# EAGLE design ESPMAX (EAGLE 6.5.0)
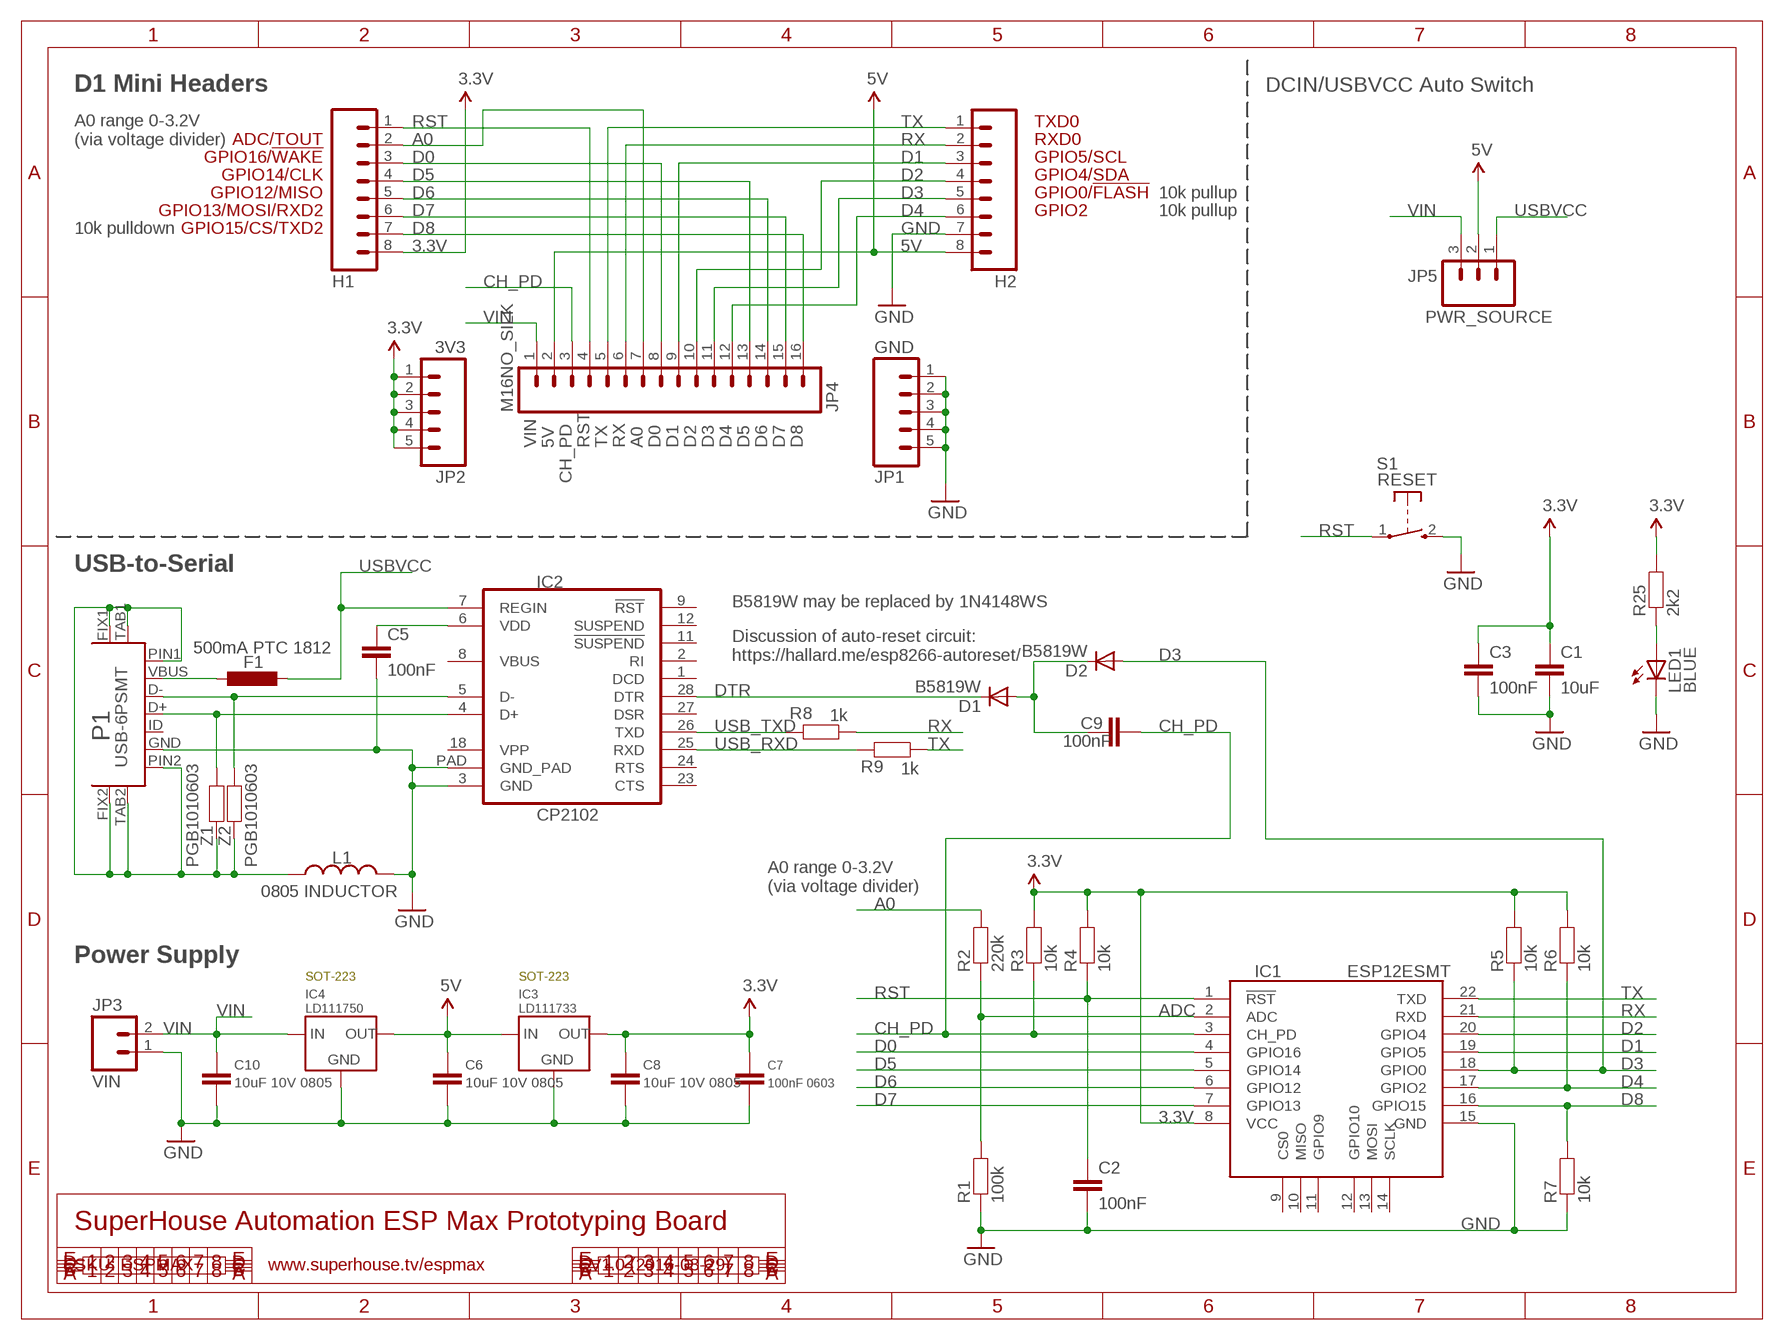
[diagram p0: schematic, sheet 1]

## Parts
C1  10uF  CAP0805  [0805]
C2  100nF  CAP0603  [0603]
C3  100nF  CAP0603  [0603]
C5  100nF  CAP0603  [0603]
C6  10uF 10V 0805  C-EUC0805  [C0805]
C7  100nF 0603  CAP0603  [0603]
C8  10uF 10V 0805  C-EUC0805  [C0805]
C9  100nF  CAP0603  [0603]
C10  10uF 10V 0805  C-EUC0805  [C0805]
D1  B5819W  DIODESOD  [SOD-323]
D2  B5819W  DIODESOD  [SOD-323]
F1  500mA PTC 1812  L-EUL1812  [L1812]
H1  M08  [1X08]
H2  M08  [1X08]
IC1  ESP12ESMT  [ESP12E]
IC2  CP2102  [QFN-28]
IC3  LD111733  LD1117-FIXED  [SOT-223]
IC4  LD111750  LD1117-FIXED  [SOT-223]
JP1  GND  M05NO_SILK  [1X05_NO_SILK]
JP2  3V3  M05NO_SILK  [1X05_NO_SILK]
JP3  VIN  M023.5MM  [SCREWTERMINAL-3.5MM-2]
JP4  M16NO_SILK  [1X16_NO_SILK]
JP5  PWR_SOURCE  M03PTH  [1X03]
L1  0805 INDUCTOR  INDUCTOR0805-LARGE  [0805-LARGE]
LED1  BLUE  LED0603  [LED-0603]
P1  USB-6PSMT  [USB-MICROB-MB05PMXX]
R1  100k  RESISTOR0603  [0603]
R2  220k  RESISTOR0603  [0603]
R3  10k  RESISTOR0603  [0603]
R4  10k  RESISTOR0603  [0603]
R5  10k  RESISTOR0603  [0603]
R6  10k  RESISTOR0603  [0603]
R7  10k  RESISTOR0603  [0603]
R8  1k  RESISTOR0603  [0603]
R9  1k  RESISTOR0603  [0603]
R25  2k2  RESISTOR0603  [0603]
S1  RESET  TAC_SWITCH_2PINSMT  [TACTILE_SWITCH_SMD_2PIN_TINY]
Z1  PGB1010603  RESISTOR0603  [0603]
Z2  PGB1010603  RESISTOR0603  [0603]

## Nets
3.3V: C1.1 C3.1 C7.1 C8.1 H1.8 IC1.8(VCC) IC3.2(OUT) IC3.4(OUT) JP2.1 JP2.2 JP2.3 JP2.4 JP2.5 R3.2 R4.2 R5.2 R6.2 R25.2
5V: C6.1 H2.8 IC3.3(IN) IC4.2(OUT) IC4.4(OUT) JP4.2 JP5.2
A0: H1.2 JP4.7 R2.2
ADC: IC1.2(ADC) R1.2 R2.1
CH_PD: C9.2 IC1.3(CH_PD) JP4.3 R3.1
D0: H1.3 IC1.4(GPIO16) JP4.8
D1: H2.3 IC1.19(GPIO5) JP4.9
D2: H2.4 IC1.20(GPIO4) JP4.10
D3: D2.2(A) H2.5 IC1.18(GPIO0) JP4.11 R5.1
D4: H2.6 IC1.17(GPIO2) JP4.12 R6.1
D5: H1.4 IC1.5(GPIO14) JP4.13
D6: H1.5 IC1.6(GPIO12) JP4.14
D7: H1.6 IC1.7(GPIO13) JP4.15
D8: H1.7 IC1.16(GPIO15) JP4.16 R7.2
DTR: D1.1(C) IC2.28(DTR)
GND: C1.2 C2.2 C3.2 C5.2 C6.2 C7.2 C8.2 C10.2 H2.7 IC1.15(GND) IC2.3(GND) IC2.PAD(GND_PAD) IC3.1(GND) IC4.1(GND) JP1.1 JP1.2 JP1.3 JP1.4 JP1.5 JP3.1 L1.2 LED1.C P1.GND R1.1 R7.1 S1.2(S)
N$23: LED1.A R25.1
N$86: C9.1 D1.2(A) D2.1(C)
N$92: L1.1 P1.FIX1 P1.FIX2 P1.PIN1 P1.PIN2 P1.TAB1 P1.TAB2 Z1.2 Z2.2
N$93: IC2.4(D+) P1.D+ Z1.1
N$94: IC2.5(D-) P1.D- Z2.1
N$95: C5.1 IC2.6(VDD)
N$115: F1.1 P1.VBUS
RST: C2.1 H1.1 IC1.1(!RST) JP4.4 R4.1 S1.1(P)
RX: H2.2 IC1.21(RXD) JP4.6 R8.1
TX: H2.1 IC1.22(TXD) JP4.5 R9.1
USB_RXD: IC2.25(RXD) R9.2
USB_TXD: IC2.26(TXD) R8.2
USBVCC: F1.2 IC2.7(REGIN) JP5.1
VIN: C10.1 IC4.3(IN) JP3.2 JP4.1 JP5.3
Unconnected: IC1.9(CS0) IC1.10(MISO) IC1.11(GPIO9) IC1.12(GPIO10) IC1.13(MOSI) IC1.14(SCLK) IC2.1(DCD) IC2.2(RI) IC2.8(VBUS) IC2.9(!RST) IC2.11(!SUSPEND) IC2.12(SUSPEND) IC2.18(VPP) IC2.23(CTS) IC2.24(RTS) IC2.27(DSR) P1.ID

## Notes on the sheet
- D1 Mini Headers | DCIN/USBVCC Auto Switch
- TXD0
- A0 range 0-3.2V
  (via voltage divider)
- ADC/TOUT | RXD0
- GPIO16/!WAKE | GPIO5/SCL
- GPIO14/CLK | GPIO4/SDA
- GPIO12/MISO | GPIO0/!FLASH | 10k pullup
- GPIO13/MOSI/RXD2 | GPIO2 | 10k pullup
- 10k pulldown | GPIO15/CS/TXD2
- VIN | 5V | RST | TX | RX | A0 | D0 | D1 | D2 | D3 | D4 | D5 | D6 | D7 | D8
- CH_PD
- USB-to-Serial
- B5819W may be replaced by 1N4148WS
- Discussion of auto-reset circuit:
  https://hallard.me/esp8266-autoreset/
- A0 range 0-3.2V
  (via voltage divider)
- Power Supply
- SOT-223 | SOT-223
- SuperHouse Automation ESP Max Prototyping Board
- SKU: ESPMAX | www.superhouse.tv/espmax | V1.0 (2016-03-29)

## Library data of the parts
C1-C3 C5 C9 = freetronics-jon:CAP: Capacitor Standard 0603 ceramic capacitor, and 0.1" leaded capacitor.
C6 C8 C10 = freetronics-jon:C-EU: CAPACITOR, European symbol
C7 = freetronics-master-v1:CAP: Capacitor Standard 0603 ceramic capacitor, and 0.1" leaded capacitor.
D1 D2 = freetronics-original:DIODE: Diode These are standard reverse protection diodes and small signal diodes. SMA package can handle up to about 1A. SOD-323 can handle about 200mA. What the SOD-323 package when ordering, there are some mfgs out there that are 5-pin packages.
F1 = rcl:L-EU: INDUCTOR, European symbol
H1 H2 = freetronics-original:M08: Header 8 Standard 8-pin 0.1" header. Use with straight break away headers (SKU : PRT-00116), right angle break away headers (PRT-00553), swiss pins (PRT-00743), machine pins (PRT-00117), and female headers (PRT-00115).
IC1 = freetronics-jon:ESP12E
IC2 = freetronics-jon:CP2102
IC3 IC4 = freetronics-luke:LD1117-FIXED: Fixed-voltage LD1117 series LDOs in SOT-223 package. Note that the ground pin is labelled as ground, not as adj, because it's not the adjustable-voltage part.
JP1 JP2 = freetronics-jon:M05: Header 5 Standard 5-pin 0.1" header. Use with straight break away headers (SKU : PRT-00116), right angle break away headers (PRT-00553), swiss pins (PRT-00743), machine pins (PRT-00117), and female headers (PRT-00115). Molex polarized connector foot print use with SKU : PRT-08230 with associated crimp pins and housings.
JP3 = freetronics-jon:M02: Header 2 Standard 2-pin 0.1" header. Use with straight break away headers (SKU : PRT-00116), right angle break away headers (PRT-00553), swiss pins (PRT-00743), machine pins (PRT-00117), and female headers (PRT-00115). Molex polarized connector foot print use with SKU : PRT-08233 with associated crimp pins and housings.
JP4 = freetronics-jon:M16
JP5 = freetronics-jon:M03: Header 3 Standard 3-pin 0.1" header. Use with straight break away headers (SKU : PRT-00116), right angle break away headers (PRT-00553), swiss pins (PRT-00743), machine pins (PRT-00117), and female headers (PRT-00115). Molex polarized connector foot print use with SKU : PRT-08232 with associated crimp pins and housings.
L1 = freetronics-master-v1:INDUCTOR: Inductors Basic Inductor/Choke - 0603 and 1206. Footprints are not proven and vary greatly between part numbers.
LED1 = freetronics-jon:LED: LEDs Standard schematic elements and footprints for 5mm, 3mm, 1206, and 0603 sized LEDs. 5mm - Spark Fun Electronics SKU : COM-00529 (and others)
P1 = freetronics-jon:USB-6P
R1-R9 R25 = freetronics-jon:RESISTOR: Resistor Basic schematic elements and footprints for 0603, 1206, and PTH 1/10th watt (small) resistors.
S1 = freetronics-jon:TAC_SWITCH_2PIN: Momentary Tactile Switch - 2 pin
Z1 Z2 = freetronics:RESISTOR: Resistor Basic schematic elements and footprints for 0603, 1206, and PTH 1/10th watt (small) resistors.

## Net classes
0 default: width 0.203 mm, drill 0.356 mm, clearance 0.152 mm
1 power: width 0.203 mm, clearance 0.152 mm

## Board
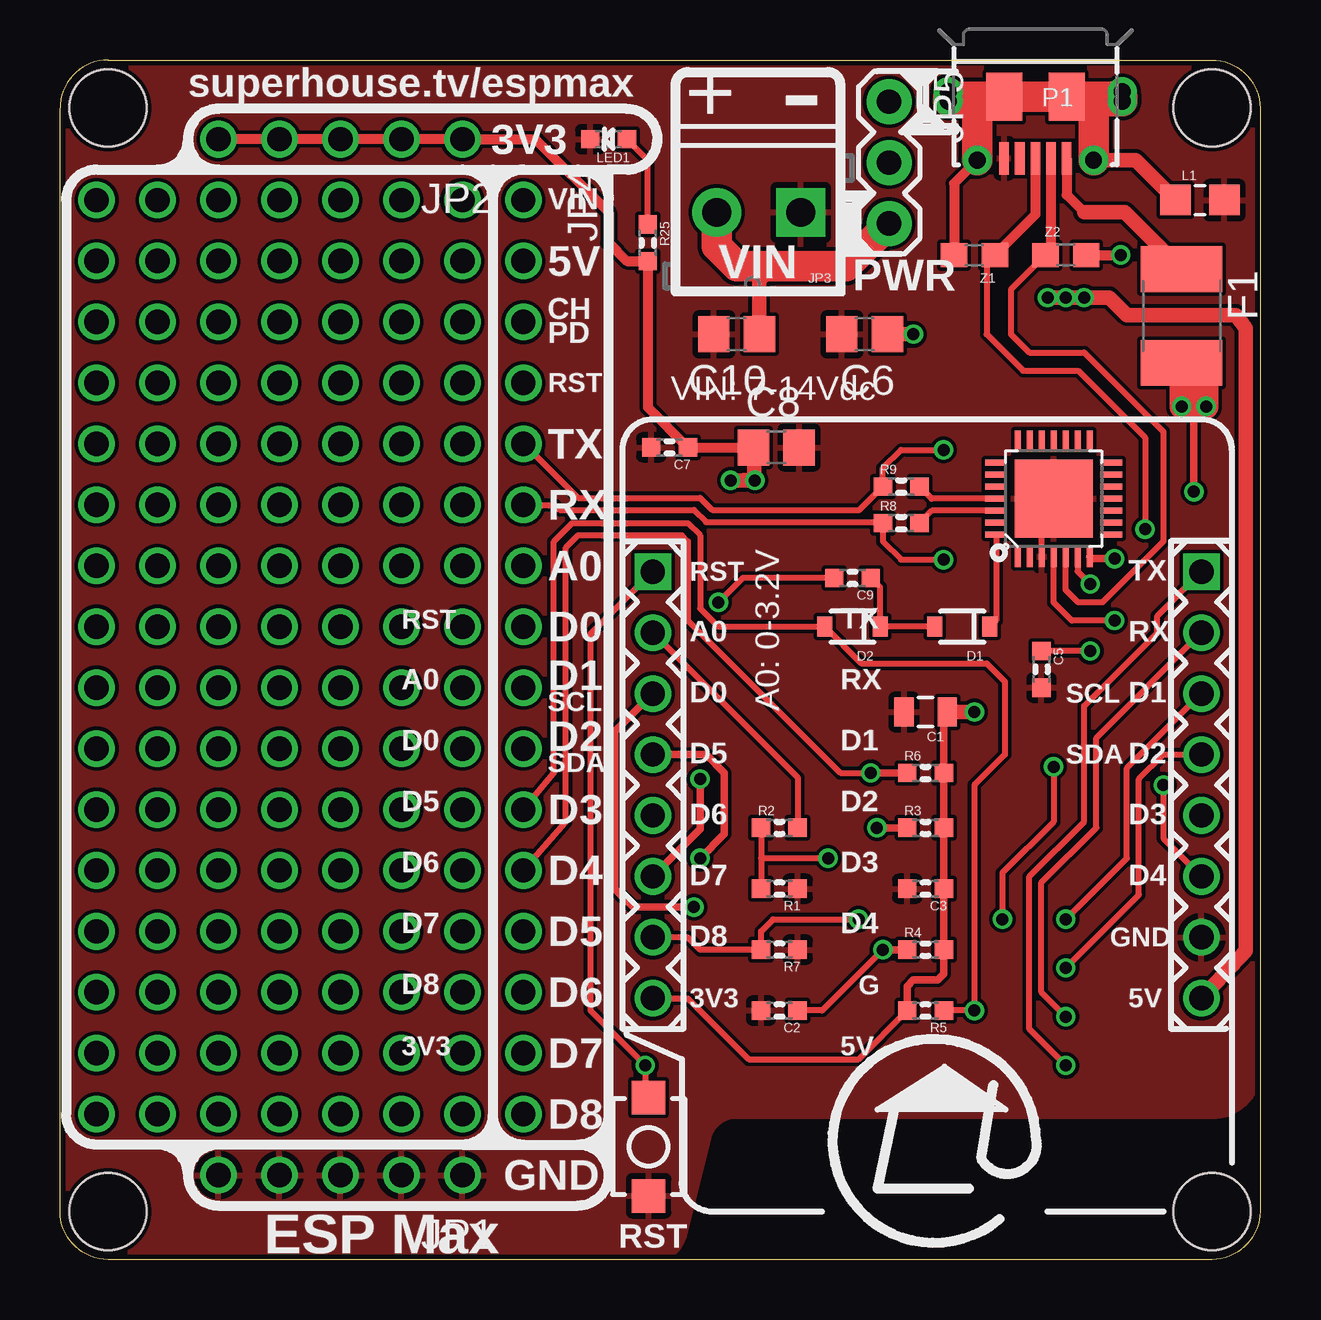
[diagram p1: board, top side]
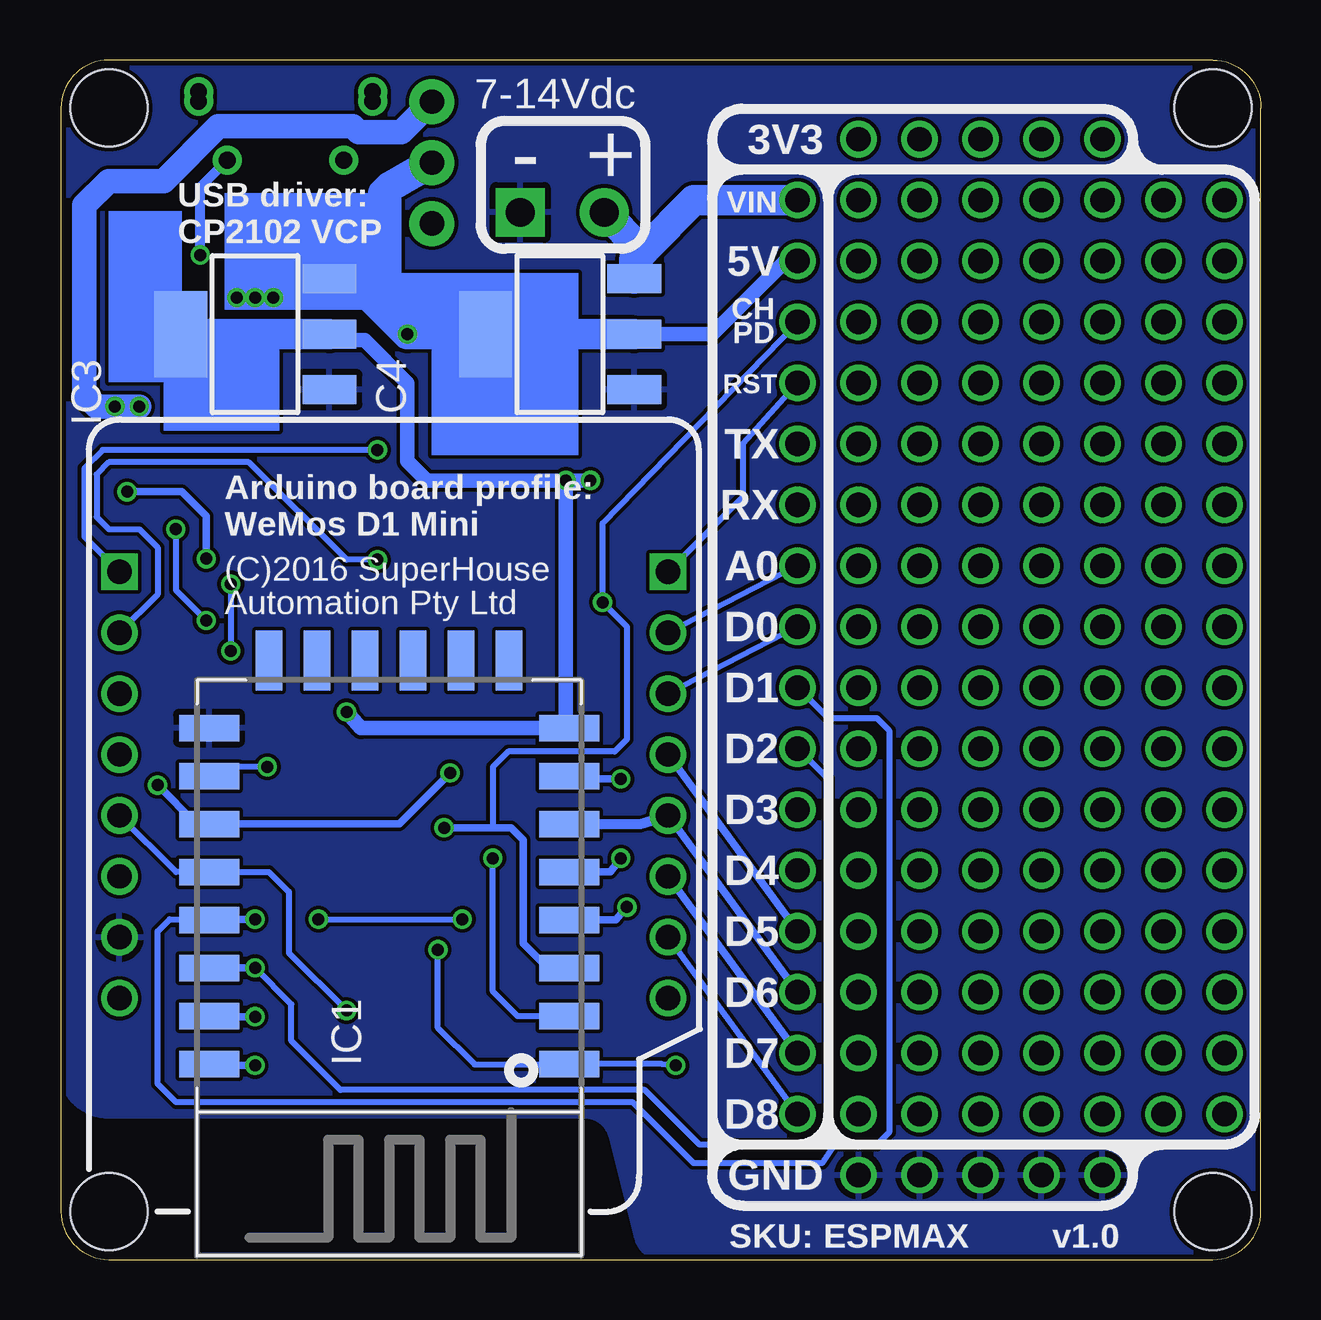
[diagram p2: board, bottom side, seen from below]

Size 50 x 50 mm. Coordinates in mm from the lower left corner, seen from the top.
Outline: 48,0 2,0 arc-90 0,2 0,48 arc-90 2,50 48,50 arc-90 50,48 50,2 arc-90 48,0
Copper layers (1*16): Top 0.035mm / dielectric 1.5mm / Bottom 0.035mm
Design rules "ElectroDragon_2layer_DRU_no_angle_20140221": minimum track width 6mil, minimum drill 12mil, track to track 6mil, track to pad 6mil, pad to pad 6mil, via to via 6mil, smd to smd 6mil, copper to edge 8mil, drill to drill 6mil, minimum pad ring 10mil, minimum via ring 6mil, stop-mask expansion 4mil, vias tented up to drill 100mil, thermal gap 10mil
Holes 3.2 mm at 2,48 2,2 48,2 48,48

### Footprints (pad centres in the part's own frame; a part is rotated, then mirrored left to right if it is on the bottom)
0805 = smd 0.8 x 1.2: 1 -0.9,0; 2 0.9,0
0603 = smd 0.762 x 0.762: 1 -0.762,0; 2 0.762,0
C0805 = smd 1.3 x 1.5: 1 -0.95,0; 2 0.95,0
SOD-323 = smd 0.63 x 0.83: 1 -1.15,0; 2 1.15,0
L1812 = smd 1.9 x 3.4: 1 -1.95,0; 2 1.95,0
1X08 = drill 1.016 square: 1 0,0 | drill 1.016: 2 2.54,0; 3 5.08,0; 4 7.62,0; 5 10.16,0; 6 12.7,0; 7 15.24,0; 8 17.78,0
ESP12E = smd 1.1 x 2.5: 1 -4,-7.5; 2 -2,-7.5; 3 0,-7.5; 4 2,-7.5; 5 4,-7.5; 6 6,-7.5; 7 8,-7.5; 8 10,-7.5; 15 10,7.5; 16 8,7.5; 17 6,7.5; 18 4,7.5; 19 2,7.5; 20 0,7.5; 21 -2,7.5; 22 -4,7.5 | smd 2.5 x 1.1: 9 12.82,-5; 10 12.82,-3; 11 12.82,-1; 12 12.82,1; 13 12.82,3; 14 12.82,5
QFN-28 = smd 0.25 x 0.9: 1 -1.5,-2.4; 2 -1,-2.4; 3 -0.5,-2.4; 4 0,-2.4; 5 0.5,-2.4; 6 1,-2.4; 7 1.5,-2.4; 15 1.5,2.4; 16 1,2.4; 17 0.5,2.4; 18 0,2.4; 19 -0.5,2.4; 20 -1,2.4; 21 -1.5,2.4 | smd 0.9 x 0.25: 8 2.4,-1.5; 9 2.4,-1; 10 2.4,-0.5; 11 2.4,0; 12 2.4,0.5; 13 2.4,1; 14 2.4,1.5; 22 -2.4,1.5; 23 -2.4,1; 24 -2.4,0.5; 25 -2.4,0; 26 -2.4,-0.5; 27 -2.4,-1; 28 -2.4,-1.5 | smd 3.25 x 3.25: PAD 0,0
SOT-223 = smd 1.219 x 2.235: 1 -2.311,-3.099; 2 0,-3.099; 3 2.311,-3.099 | smd 3.6 x 2.2: 4 0,3.099
1X05_NO_SILK = drill 1.016: 1 0,0; 2 2.54,0; 3 5.08,0; 4 7.62,0; 5 10.16,0
SCREWTERMINAL-3.5MM-2 = drill 1.2 pad 2.032 square: 1 0,0 | drill 1.2 pad 2.032: 2 3.5,0
1X16_NO_SILK = drill 1.016: 1 0,0; 2 2.54,0; 3 5.08,0; 4 7.62,0; 5 10.16,0; 6 12.7,0; 7 15.24,0; 8 17.78,0; 9 20.32,0; 10 22.86,0; 11 25.4,0; 12 27.94,0; 13 30.48,0; 14 33.02,0; 15 35.56,0; 16 38.1,0
1X03 = drill 1.016 pad 1.88: 1 0,0; 2 2.54,0; 3 5.08,0
0805-LARGE = smd 1.27 x 1.27: 1 -1.016,0; 2 1.016,0
LED-0603 = smd 0.762 x 0.762: A -0.762,0; C 0.762,0
USB-MICROB-MB05PMXX = smd 0.4 x 1.35: D+ 0,2.575; D- -0.65,2.575; GND 1.3,2.575; ID 0.65,2.575; VBUS -1.3,2.575 | smd 1.5 x 2: FIX1 -1.3,0; FIX2 1.3,0 | drill 0.7: PIN1 -2.425,2.65; PIN2 2.425,2.65; SLOT1 -3.625,-0.2; SLOT2 3.625,-0.2; TAB1 -3.625,0.2; TAB2 3.625,0.2
TACTILE_SWITCH_SMD_2PIN_TINY = smd 1.4 x 1.4: 1 -2.05,0; 2 2.05,0
0603' = smd 1.1 x 1: 1 -0.85,0; 2 0.85,0

### Placement (x,y rotation side)
C1  36.07,22.82 180 top
C2  29.97,10.38 180 top
C3  36.07,15.46 180 top
C5  40.89,24.6 270 top
C6  33.53,38.57 180 top
C7  25.4,33.85 180 top
C8  29.84,33.85 0 top
C9  33.02,28.41 180 top
C10  28.19,38.57 180 top
D1  37.59,26.38 180 top
D2  33.02,26.38 180 top
F1  46.74,39.33 270 top
H1  24.7,28.67 270 top
H2  47.56,28.67 270 top
IC1  36.32,12.15 90 bottom
IC2  41.4,31.71 0 top
IC3  41.91,38.57 90 bottom
IC4  29.21,38.57 90 bottom
JP1  16.76,3.52 180 top
JP2  16.76,46.7 180 top
JP3  30.86,43.65 180 top
JP4  19.3,44.16 270 top
JP5  34.54,48.26 270 top
L1  47.5,44.16 0 top
LED1  22.86,46.7 180 top
P1  40.64,48.48 180 top
R1  29.97,15.46 180 top
R2  29.97,18 0 top
R3  36.07,18 0 top
R4  36.07,12.92 0 top
R5  36.07,10.38 180 top
R6  36.07,20.28 0 top
R7  29.97,12.92 180 top
R8  35.05,30.7 0 top
R9  35.05,32.22 0 top
R25  24.49,42.38 270 top
S1  24.52,4.7 270 top
Z1  PGB1010603  [0603']  38.1,41.87 180 top
Z2  PGB1010603  [0603']  41.91,41.87 0 top

### Tracks (layer width: path | path; a pad name or v marks a point on that pad's centre or on a via)
3.3V  (via drill 0.5)
  Top 0.254: H1.8 26.16,10.88 28.7,8.34 33.27,8.34 R5.2
  Top 0.305: R5.2 35.31,11.39 35.56,11.65 36.58,11.65 36.83,11.9 R4.2 C3.1 R3.2 R6.2 36.83,22.94 C1.1 | H1.8
  Top 0.406: JP2.5 JP2.4 JP2.3 JP2.2 JP2.1 19.81,46.7 22.86,43.65 22.86,42.38 23.62,41.62 R25.2 24.49,35.52 C7.1 C8.1
  Top 0.61: C1.1 v38.1,22.82 | C8.1 28.96,32.52 v27.94,32.47 v28.96,32.47
  Bottom 0.61: v38.1,22.82 37.5,22.15 IC1.8 28.96,22.29 v28.96,32.47 | IC3.2 38.1,38.57 37.85,38.32 37.34,38.32 35.56,36.54 35.56,33.27 34.76,32.47 v28.96,32.47 | v28.96,32.47 v27.94,32.47
  Bottom 1.27: IC3.2 IC3.4
5V  (via drill 0.5)
  Top 0.61: H2.8 49.4,12.86 49.4,38.82 48.98,39.37 44.45,39.37 43.73,40.09 v41.15,40.09 | C6.1 v35.56,38.57
  Bottom 0.61: IC4.2 22.86,38.57 19.81,41.62 JP4.2 | IC3.3 39.09,40.6 40.64,40.6 v41.15,40.09 v41.91,40.09 v42.67,40.09
  Bottom 1.27: IC4.2 IC4.4 v35.56,38.57 37.87,40.88 | 37.87,40.88 IC3.3 | 37.87,42.39 37.87,42.16 | 37.87,42.16 37.87,40.88 | JP5.2 36.32,44.7 36.58,44.45 36.58,43.46 37.87,42.16
A0
  Top 0.254: H1.2 30.73,20.1 R2.2
  Bottom 0.254: JP4.7 H1.2
ADC  (via drill 0.5)
  Top 0.254: R2.1 29.21,16.73 | 29.21,16.73 R1.2 | v32,16.73 29.21,16.73
  Bottom 0.254: v32,16.73 32,11.18 30.98,10.15 IC1.2
CH_PD  (via drill 0.5)
  Top 0.254: C9.2 28.45,28.41 v27.43,27.39
  Top 0.305: v34.04,18 R3.1
  Bottom 0.254: JP4.3 27.43,30.7 v27.43,27.39 26.42,26.38 26.42,21.68 26.92,21.17 31.37,21.17 32,20.54 32,18
  Bottom 0.305: 29.72,12.15 30.73,13.17 30.73,17.49 31.24,18 32,18 v34.04,18
  Bottom 0.406: IC1.3 29.72,12.15
D0  (via drill 0.5)
  Top 0.305: v26.42,14.69 23.88,14.69 23.11,15.46 23.11,22 H1.3
  Bottom 0.254: JP4.8 H1.3
  Bottom 0.305: IC1.4 26.89,14.15 v26.42,14.69
D1  (via drill 0.5)
  Top 0.254: v41.91,14.19 44.45,16.73 44.45,20.48 H2.3
  Bottom 0.254: JP4.9 18.03,22.57 16,22.57 15.49,22.06 15.49,5.3 16,4.79 17.78,4.79 18.29,4.03 23.65,4.03 26.18,6.56 45.2,6.56 45.97,7.33 45.97,13.68 45.47,14.19 44.11,14.19 IC1.19
  Bottom 0.305: IC1.19 43.79,14.19 v41.91,14.19
D2  (via drill 0.5)
  Top 0.254: v41.91,12.15 44.96,15.2 44.96,20.03 45.98,21.05 H2.4
  Bottom 0.254: JP4.10 18.03,20.03 18.03,5.55 18.8,4.79 23.39,4.79 25.67,7.07 38.35,7.07 40.39,9.11 40.39,10.64 v41.91,12.15
  Bottom 0.305: IC1.20 v41.91,12.15
D3  (via drill 0.5)
  Top 0.254: R5.1 v38.1,10.38 38.1,19.77 39.37,21.04 39.37,24.09 38.61,24.85 33.39,24.85 D2.2 27.43,26.38 26.67,27.14 26.67,30.19 26.16,30.7 21.34,30.7 20.57,29.93 20.57,20.28 JP4.11
  Bottom 0.254: H2.5 45.2,16.15 IC1.18 41.33,16.15 40.5,15.32 40.5,12.78 v38.1,10.38
D4  (via drill 0.5)
  Top 0.254: v45.97,19.77 45.97,17.56 H2.6 | JP4.12 21.08,18.25 21.08,29.68 21.59,30.19 25.91,30.19 26.16,29.93 26.16,26.63 32.51,20.28 v33.78,20.28
  Top 0.305: v33.78,20.28 R6.1
  Bottom 0.305: v45.97,19.77 44.35,18.15 IC1.17 35.91,18.15 v33.78,20.28
D5  (via drill 0.5)
  Top 0.305: v26.67,16.73 27.69,17.74 27.69,20.28 26.92,21.04 H1.4
  Bottom 0.305: JP4.13 H1.4 | IC1.5 27.11,16.15 v26.67,16.73
D6
  Bottom 0.305: JP4.14 H1.5
  Bottom 0.406: IC1.6 25.87,18.15 H1.5
D7  (via drill 0.5)
  Top 0.305: H1.6 26.67,17.94 v26.67,20.03
  Bottom 0.305: v26.67,20.03 28.19,20.03 28.57,19.9 IC1.7 | JP4.15 H1.6
D8  (via drill 0.5)
  Top 0.254: v41.4,20.54 41.4,18.25 39.27,16.12 v39.27,14.19 | v33.27,14.19 29.72,14.19 29.21,13.68 R7.2 26.67,12.92 26.16,13.42 H1.7
  Bottom 0.254: v39.27,14.19 v33.27,14.19 | JP4.16 H1.7 | v41.4,20.54 43.44,20.54 IC1.16
DTR
  Top 0.254: IC2.28 39,26.64 D1.1
GND
  Top 0.254: IC2.3 40.9,31.21 IC2.PAD
  pour Top: 48,5.98 arc90 50,7.98 50,48 arc90 48,50 2,50 arc90 0,48 0,2 arc90 2,0 25,0 arc60 26,1 27,4.98 arc-70 28,5.98
  pour Bottom: 2,0 25,0 arc70 26,1 27,4.98 arc-70 28,5.98 48,5.98 arc90 50,7.98 50,48 arc90 48,50 2,50 arc90 0,48 0,2 arc90
N$1  (via drill 1.02)
  other vias: 9.14,41.62
N$2  (via drill 1.02)
  other vias: 6.6,41.62
N$3  (via drill 1.02)
  other vias: 11.68,41.62
N$4  (via drill 1.02)
  other vias: 14.22,41.62
N$5  (via drill 1.02)
  other vias: 16.76,41.62
N$6  (via drill 1.02)
  other vias: 1.52,41.62
N$7  (via drill 1.02)
  other vias: 9.14,39.08
N$8  (via drill 1.02)
  other vias: 6.6,39.08
N$9  (via drill 1.02)
  other vias: 11.68,39.08
N$10  (via drill 1.02)
  other vias: 14.22,39.08
N$11  (via drill 1.02)
  other vias: 16.76,39.08
N$12  (via drill 1.02)
  other vias: 1.52,39.08
N$13  (via drill 1.02)
  other vias: 9.14,36.54
N$14  (via drill 1.02)
  other vias: 6.6,36.54
N$15  (via drill 1.02)
  other vias: 11.68,36.54
N$16  (via drill 1.02)
  other vias: 14.22,36.54
N$17  (via drill 1.02)
  other vias: 16.76,36.54
N$18  (via drill 1.02)
  other vias: 1.52,36.54
N$19  (via drill 1.02)
  other vias: 9.14,34
N$20  (via drill 1.02)
  other vias: 6.6,34
N$21  (via drill 1.02)
  other vias: 11.68,34
N$22  (via drill 1.02)
  other vias: 14.22,34
N$23
  Top 0.254: R25.1 24.49,45.83 LED1.A
N$24  (via drill 1.02)
  other vias: 16.76,34
N$25  (via drill 1.02)
  other vias: 1.52,34
N$26  (via drill 1.02)
  other vias: 9.14,31.46
N$27  (via drill 1.02)
  other vias: 6.6,31.46
N$28  (via drill 1.02)
  other vias: 11.68,31.46
N$29  (via drill 1.02)
  other vias: 14.22,31.46
N$30  (via drill 1.02)
  other vias: 16.76,31.46
N$31  (via drill 1.02)
  other vias: 1.52,31.46
N$32  (via drill 1.02)
  other vias: 9.14,28.92
N$33  (via drill 1.02)
  other vias: 6.6,28.92
N$34  (via drill 1.02)
  other vias: 11.68,28.92
N$35  (via drill 1.02)
  other vias: 14.22,28.92
N$36  (via drill 1.02)
  other vias: 16.76,28.92
N$37  (via drill 1.02)
  other vias: 1.52,28.92
N$38  (via drill 1.02)
  other vias: 9.14,26.38
N$39  (via drill 1.02)
  other vias: 6.6,26.38
N$40  (via drill 1.02)
  other vias: 11.68,26.38
N$41  (via drill 1.02)
  other vias: 14.22,26.38
N$42  (via drill 1.02)
  other vias: 16.76,26.38
N$43  (via drill 1.02)
  other vias: 1.52,26.38
N$44  (via drill 1.02)
  other vias: 9.14,23.84
N$45  (via drill 1.02)
  other vias: 6.6,23.84
N$46  (via drill 1.02)
  other vias: 11.68,23.84
N$47  (via drill 1.02)
  other vias: 14.22,23.84
N$48  (via drill 1.02)
  other vias: 16.76,23.84
N$49  (via drill 1.02)
  other vias: 1.52,23.84
N$50  (via drill 1.02)
  other vias: 9.14,21.3
N$51  (via drill 1.02)
  other vias: 6.6,21.3
N$52  (via drill 1.02)
  other vias: 11.68,21.3
N$53  (via drill 1.02)
  other vias: 14.22,21.3
N$54  (via drill 1.02)
  other vias: 16.76,21.3
N$55  (via drill 1.02)
  other vias: 1.52,21.3
N$56  (via drill 1.02)
  other vias: 9.14,18.76
N$57  (via drill 1.02)
  other vias: 6.6,18.76
N$58  (via drill 1.02)
  other vias: 11.68,18.76
N$59  (via drill 1.02)
  other vias: 14.22,18.76
N$60  (via drill 1.02)
  other vias: 16.76,18.76
N$61  (via drill 1.02)
  other vias: 1.52,18.76
N$62  (via drill 1.02)
  other vias: 9.14,16.22
N$63  (via drill 1.02)
  other vias: 6.6,16.22
N$64  (via drill 1.02)
  other vias: 11.68,16.22
N$65  (via drill 1.02)
  other vias: 14.22,16.22
N$66  (via drill 1.02)
  other vias: 16.76,16.22
N$67  (via drill 1.02)
  other vias: 1.52,16.22
N$68  (via drill 1.02)
  other vias: 9.14,13.68
N$69  (via drill 1.02)
  other vias: 6.6,13.68
N$70  (via drill 1.02)
  other vias: 11.68,13.68
N$71  (via drill 1.02)
  other vias: 14.22,13.68
N$72  (via drill 1.02)
  other vias: 16.76,13.68
N$73  (via drill 1.02)
  other vias: 1.52,13.68
N$74  (via drill 1.02)
  other vias: 9.14,11.14
N$75  (via drill 1.02)
  other vias: 6.6,11.14
N$76  (via drill 1.02)
  other vias: 11.68,11.14
N$77  (via drill 1.02)
  other vias: 14.22,11.14
N$78  (via drill 1.02)
  other vias: 16.76,11.14
N$79  (via drill 1.02)
  other vias: 1.52,11.14
N$80  (via drill 1.02)
  other vias: 9.14,8.6
N$81  (via drill 1.02)
  other vias: 6.6,8.6
N$82  (via drill 1.02)
  other vias: 11.68,8.6
N$83  (via drill 1.02)
  other vias: 14.22,8.6
N$84  (via drill 1.02)
  other vias: 16.76,8.6
N$85  (via drill 1.02)
  other vias: 1.52,8.6
N$86
  Top 0.254: D1.2 D2.1 34.17,28.02 C9.1
N$87  (via drill 1.02)
  other vias: 9.14,44.16
N$88  (via drill 1.02)
  other vias: 6.6,44.16
N$89  (via drill 1.02)
  other vias: 11.68,44.16
N$90  (via drill 1.02)
  other vias: 14.22,44.16
N$91  (via drill 1.02)
  other vias: 16.76,44.16
N$92  (via drill 0.5)
  Top 0.406: P1.PIN2 37.25,44.86 Z1.2 | Z2.2 v44.2,41.87
  Top 0.61: L1.1 44.81,45.83 P1.PIN1
  Top 1.27: P1.PIN1 43.06,48.28 P1.TAB1 44.27,48.48 P1.FIX1 P1.FIX2 37.02,48.48 P1.TAB2 38.22,48.28 P1.PIN2
  Bottom 0.406: v44.2,41.87 44.2,44.7 P1.PIN1
N$93  (via drill 0.5)
  Top 0.254: Z1.1 38.61,41.53 38.61,38.57 40.13,37.05 42.42,37.05 45.21,34.25 v45.21,30.44 | v43.94,26.63 42.16,26.63 41.4,27.39 IC2.4
  Top 0.406: P1.D+ 40.64,43.56 Z1.1
  Bottom 0.254: v45.21,30.44 45.21,27.9 v43.94,26.63
N$94
  Top 0.254: IC2.5 41.9,27.91 42.42,27.39 43.43,27.39 45.97,29.93 45.97,34.51 42.67,37.81 40.39,37.81 39.62,38.57 39.62,40.44 Z2.1
  Top 0.406: P1.D- 41.29,42.1 Z2.1
N$95  (via drill 0.5)
  Top 0.254: IC2.6 42.4,28.68 v42.93,28.16 | v42.93,25.36 C5.1
  Bottom 0.254: v42.93,28.16 v42.93,25.36
N$96  (via drill 1.02)
  other vias: 4.06,44.16
N$97  (via drill 1.02)
  other vias: 4.06,41.62
N$98  (via drill 1.02)
  other vias: 4.06,39.08
N$99  (via drill 1.02)
  other vias: 4.06,36.54
N$100  (via drill 1.02)
  other vias: 4.06,34
N$101  (via drill 1.02)
  other vias: 4.06,31.46
N$102  (via drill 1.02)
  other vias: 4.06,28.92
N$103  (via drill 1.02)
  other vias: 4.06,26.38
N$104  (via drill 1.02)
  other vias: 4.06,23.84
N$105  (via drill 1.02)
  other vias: 4.06,21.3
N$106  (via drill 1.02)
  other vias: 4.06,18.76
N$107  (via drill 1.02)
  other vias: 4.06,16.22
N$108  (via drill 1.02)
  other vias: 4.06,13.68
N$109  (via drill 1.02)
  other vias: 4.06,11.14
N$110  (via drill 1.02)
  other vias: 4.06,8.6
N$111  (via drill 1.02)
  other vias: 1.52,44.16
N$112  (via drill 1.02)
  other vias: 9.14,6.06
N$113  (via drill 1.02)
  other vias: 6.6,6.06
N$114  (via drill 1.02)
  other vias: 11.68,6.06
N$115
  Top 0.254: 46.99,41.03 47.24,41.28 F1.1
  Top 0.406: P1.VBUS 41.94,44.38 42.67,43.65
  Top 0.61: 42.67,43.65 44.37,43.65 46.99,41.03
N$116  (via drill 1.02)
  other vias: 14.22,6.06
N$117  (via drill 1.02)
  other vias: 16.76,6.06
N$118  (via drill 1.02)
  other vias: 4.06,6.06
N$119  (via drill 1.02)
  other vias: 1.52,6.06
RST  (via drill 0.5)
  Top 0.254: H1.1 22.1,26.07 22.1,10.38 v24.38,8.09 24.38,6.89 S1.1 | v34.29,12.92 31.75,10.38 C2.1
  Top 0.305: R4.1 v34.29,12.92
  Bottom 0.254: JP4.4 21.59,34 21.59,31.78 H1.1 | v24.38,8.09 24.96,8.15 IC1.1 28.85,8.13 32.77,8.13 34.29,9.65 v34.29,12.92
RX  (via drill 0.5)
  Top 0.254: v41.91,10.12 40.89,11.14 40.89,15.71 43.18,18 43.18,21.75 H2.2 | v36.81,29.17 35.05,29.17 34.29,29.93 R8.1 34.25,30.73 26.92,30.73 26.42,31.24 20.83,31.24 20.61,31.46 JP4.6
  Bottom 0.254: v36.81,29.17 38.1,29.17 42.16,33.24 48.01,33.24 48.51,32.73 48.51,30.95 48.01,30.44 46.74,30.44 45.97,29.68 45.97,27.72 H2.2
  Bottom 0.305: IC1.21 43.79,10.12 v41.91,10.12
TX  (via drill 0.5)
  Top 0.254: v41.91,8.09 40.39,9.61 40.39,15.96 42.67,18.25 42.67,23.08 45.72,26.12 45.72,26.83 H2.1 | v36.81,33.74 35.05,33.74 34.29,32.98 R9.1 33.31,31.24 27.18,31.24 26.67,31.75 21.59,31.75 19.34,34 JP4.5
  Bottom 0.254: v36.81,33.74 48.26,33.74 49.02,32.98 49.02,30.13 H2.1
  Bottom 0.305: IC1.22 43.76,8.09 v41.91,8.09
USB_RXD
  Top 0.254: IC2.25 36.32,31.71 R9.2
USB_TXD
  Top 0.254: IC2.26 36.33,31.21 R8.2
USBVCC  (via drill 0.5)
  Top 0.305: IC2.7 43,29.21 v43.94,29.21 | v47.24,32 47.24,36.83 47.5,37.08 F1.2
  Top 1.016: v46.74,35.56 F1.2 47.03,37.08 47.75,37.08 v47.75,35.56 v46.74,35.56
  Bottom 0.305: v43.94,29.21 43.94,30.99 44.96,32 v47.24,32
  Bottom 1.016: JP5.1 35.81,46.99 37.59,46.99 37.85,47.24 43.43,47.24 45.72,44.96 48.01,44.96 49.02,43.94 49.02,36.07 48.51,35.56 v46.74,35.56
VIN
  Top 0.61: C10.1 29.14,40.83 29.72,41.4
  Top 1.27: JP5.3 32.77,41.4 29.72,41.4 28.19,41.4 27.36,42.23 JP3.2
  Bottom 1.27: JP4.1 23.62,44.16 25.64,42.15 | 25.64,42.15 26.11,41.67 IC4.3 | JP3.2 25.86,42.15 25.64,42.15
(copper drawn outside any net)
  shapes: Bottom area x10

### Text on the board
tPlace: superhouse.tv/espmax | + | - | 3V3 | VIN | 5V | VIN | PWR | CH / PD | RST | VIN: 7-14Vdc | TX | RX | A0 | RST | TX | D0 | A0 | RX | D1 | SCL | D0 | A0: 0-3.2V | SCL | D1 | D2 | D5 | SDA | D2 | SDA | D3 | D6 | D3 | D4 | D7 | D4 | D5 | D8 | GND | D6 | 3V3 | 5V | D7 | D8 | GND | ESP Max | RST
bPlace: 7-14Vdc | 3V3 | VIN | + | - | 5V | USB driver: / CP2102 VCP | CH / PD | RST | TX | RX | A0 | Arduino board profile: / WeMos D1 Mini | D0 | (C)2016 SuperHouse / Automation Pty Ltd | D1 | D2 | D3 | D4 | D5 | D6 | D7 | D8 | GND | v1.0 | SKU: ESPMAX
tNames: RST | TX | A0 | RX | D0 | D1 | D5 | D2 | D6 | D3 | D7 | D4 | D8 | G | 3V3 | 5V